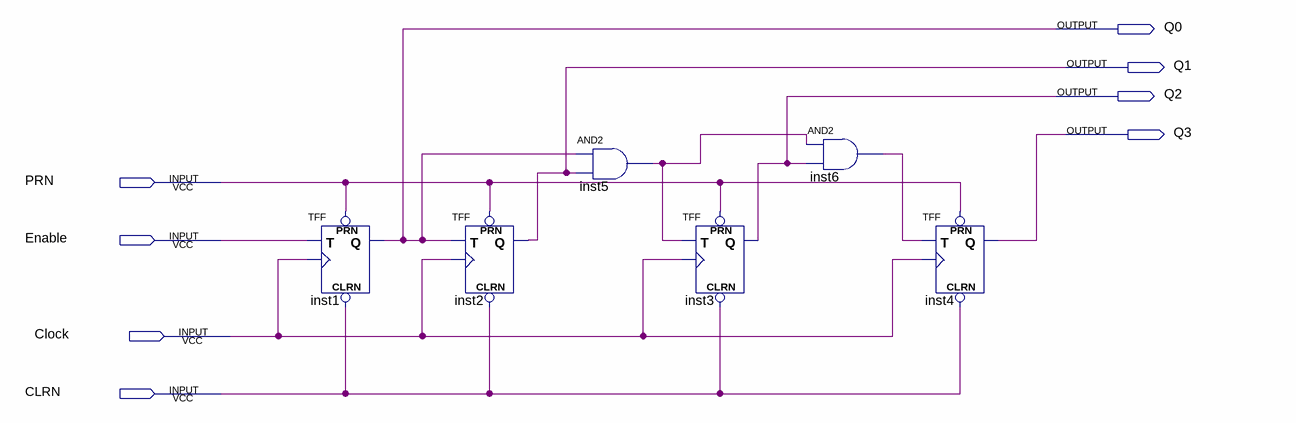
[diagram p0: schematic sheet]
// Quartus schematic lab10step2.bdf as structural Verilog: 6 symbols, 8 pins
module lab10step2 (
  input  PRN,
  input  Enable,
  input  Clock,
  input  CLRN,
  output Q0,
  output Q1,
  output Q2,
  output Q3
);

  wire inst5_out, inst6_out;

  TFF inst1 (.PRN(PRN), .CLRN(CLRN), .T(Enable), .CLK(Clock), .Q(Q0));
  TFF inst2 (.PRN(PRN), .CLRN(CLRN), .T(Q0), .CLK(Clock), .Q(Q1));
  and inst5 (inst5_out, Q0, Q1);
  TFF inst3 (.PRN(PRN), .CLRN(CLRN), .T(inst5_out), .CLK(Clock), .Q(Q2));
  and inst6 (inst6_out, inst5_out, Q2);
  TFF inst4 (.PRN(PRN), .CLRN(CLRN), .T(inst6_out), .CLK(Clock), .Q(Q3));
endmodule
